# EAGLE design Shield (EAGLE 7.5.0)
USB / DC Solar Charger, Fuel gauge, Buck / Boost converter Shield
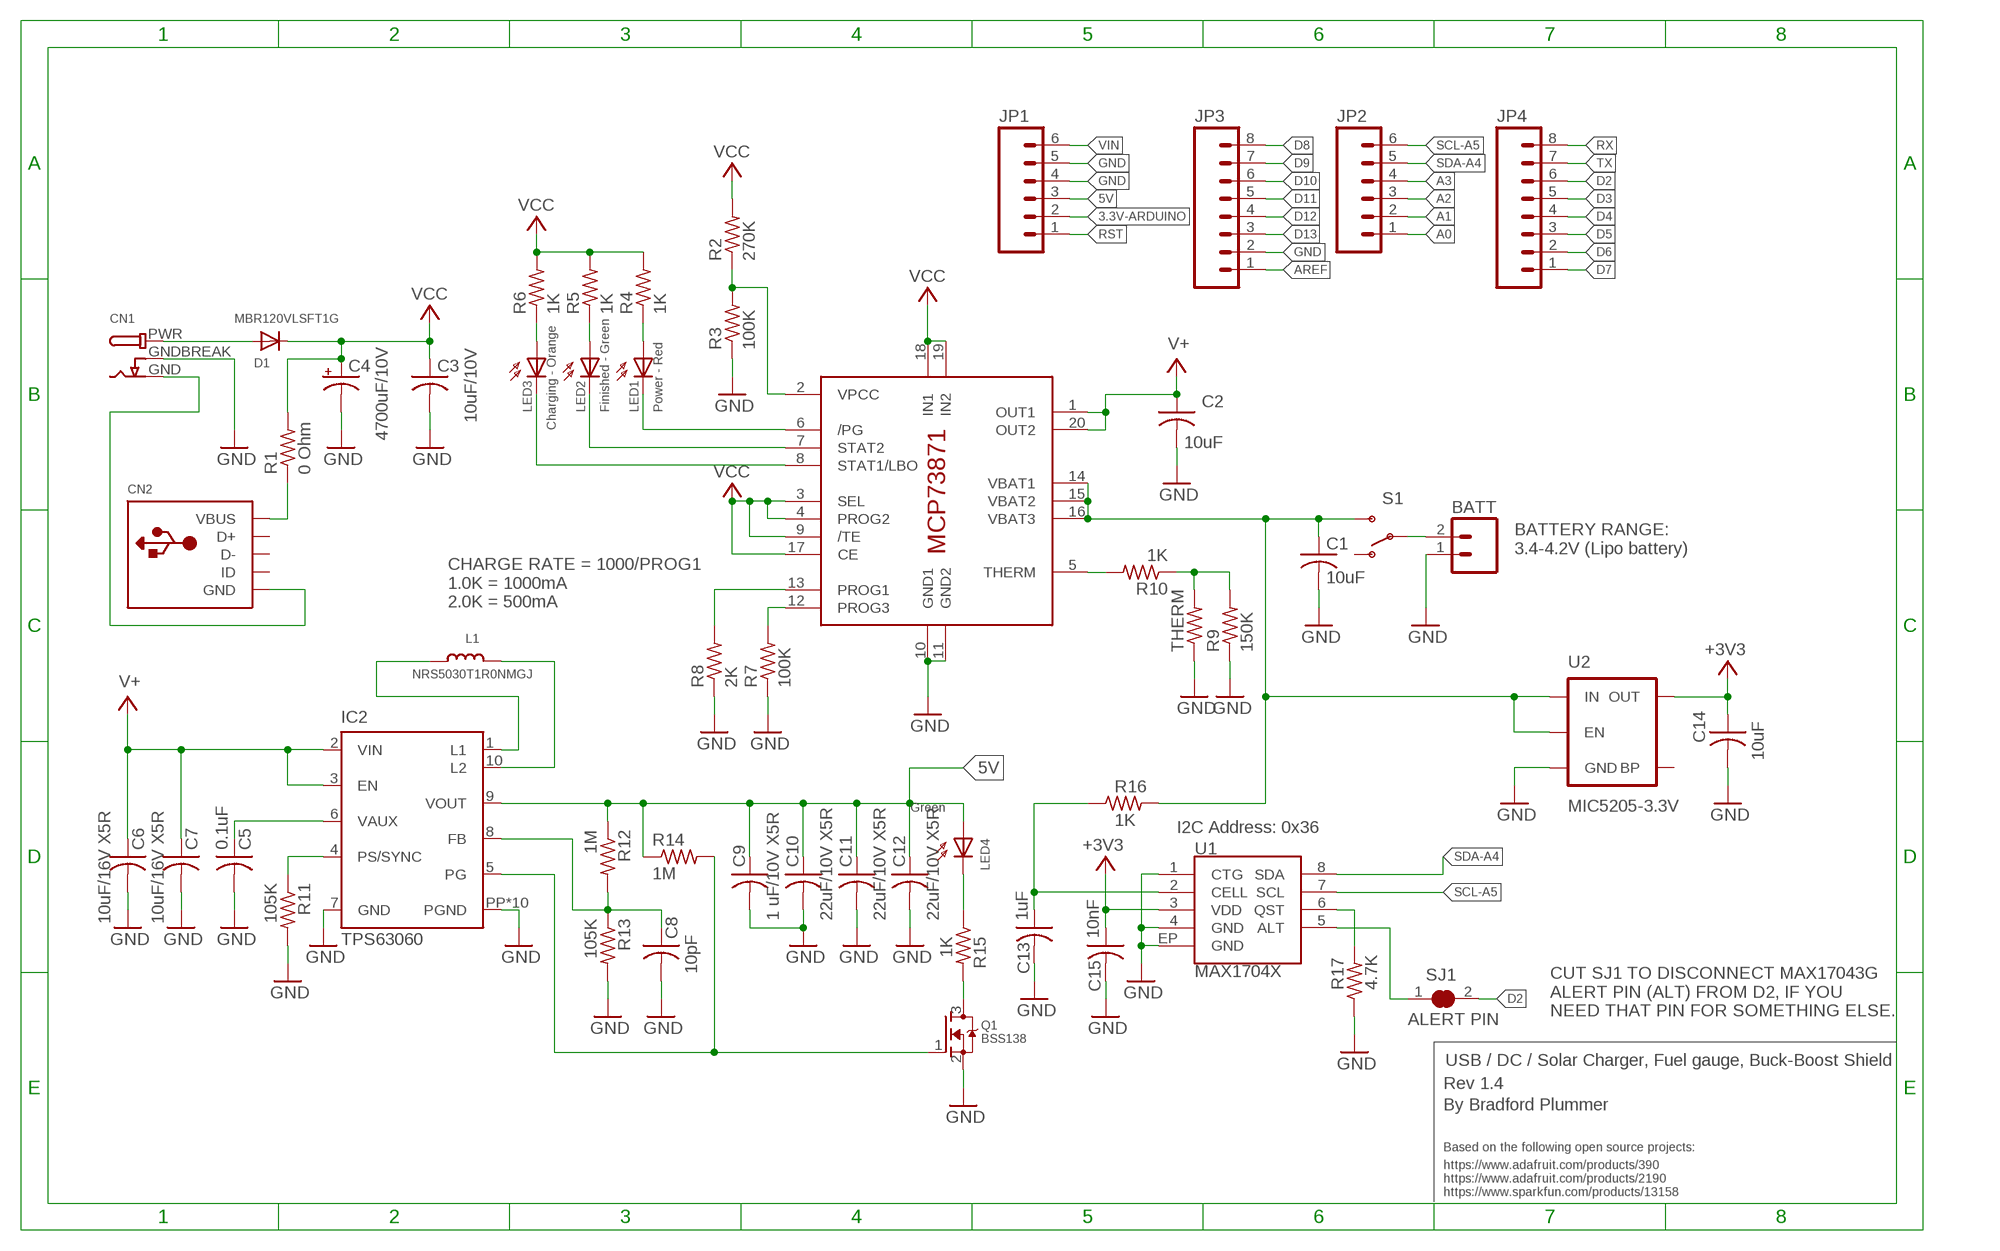
[diagram p0: schematic, sheet 1]

## Parts
BATT  M02JST-PTH-VERT  [JST-2-PTH-VERT]
C1  10uF  C-USC0805K  [C0805K]
C2  10uF  C-USC0805K  [C0805K]
C3  10uF/10V  C-USC0805K  [C0805K]
C4  4700uF/10V  CPOL-USE5-13  [E5-13]
C5  0.1uF  C-USC0805K  [C0805K]
C6  10uF/16V X5R  C-USC0805K  [C0805K]
C7  10uF/16V X5R  C-USC0805K  [C0805K]
C8  10pF  C-USC0805K  [C0805K]
C9  1 uF/10V X5R  C-USC0805K  [C0805K]
C10  22uF/10V X5R  C-USC0805K  [C0805K]
C11  22uF/10V X5R  C-USC0805K  [C0805K]
C12  22uF/10V X5R  C-USC0805K  [C0805K]
C13  1uF  C-USC0805K  [C0805K]
C14  10uF  C-USC0805K  [C0805K]
C15  10nF  C-USC0805K  [C0805K]
CN1  DCBARREL1.3MM  [DCJACK_1.3MM_PTH]
CN2  USBMINIB  [USB-MINIB]
D1  MBR120VLSFT1G  DIODESOD-123  [SOD-123]
IC1  MCP73871  [QFN20]
IC2  TPS63060  [DSC-S-PWSON-N10]
JP1  M06NO_SILK_FEMALE_PTH  [1X06_NO_SILK]
JP2  M06NO_SILK_FEMALE_PTH  [1X06_NO_SILK]
JP3  M08NO_SILK_FEMALE_PTH  [1X08_NO_SILK]
JP4  M08NO_SILK_FEMALE_PTH  [1X08_NO_SILK]
L1  NRS5030T1R0NMGJ  INDUCTORTDK_VLC5045  [INDUCTOR_5X5MM_TDK_VLC5045]
LED1  Power - Red  SFH205  [SFH205]
LED2  Finished - Green  SFH205  [SFH205]
LED3  Charging - Orange  SFH205  [SFH205]
LED4  Green  SFH205  [SFH205]
Q1  BSS138  MOSFET-NWIDE  [SOT23-WIDE]
R1  0 Ohm  R-US_R0805  [R0805]
R2  270K  R-US_R0805  [R0805]
R3  100K  R-US_R0805  [R0805]
R4  1K  R-US_R0805  [R0805]
R5  1K  R-US_R0805  [R0805]
R6  1K  R-US_R0805  [R0805]
R7  100K  R-US_R0805  [R0805]
R8  2K  R-US_R0805  [R0805]
R9  150K  R-US_M0805  [M0805]
R10  1K  R-US_M0805  [M0805]
R11  105K  R-US_M0805  [M0805]
R12  1M  R-US_M0805  [M0805]
R13  105K  R-US_M0805  [M0805]
R14  1M  R-US_M0805  [M0805]
R15  1K  R-US_M0805  [M0805]
R16  1K  R-US_M0805  [M0805]
R17  4.7K  R-US_M0805  [M0805]
S1  SWITCH-SPDTPTH  [SWITCH-SPDT]
SJ1  ALERT PIN  SJ  [SJ]
THERM  R-US_FLIPFLOP  [0805-THM]
U1  MAX1704X  [TDFN-8]
U2  MIC5205-3.3V  MIC52053.3V  [SOT23-5]

## Nets
3.3V-ARDUINO: JP1.2
5V: C9.1 C10.1 C11.1 C12.1 IC2.9(VOUT) JP1.3 LED4.A R12.1 R14.1
+3V3: C14.1 C15.1 U1.3(VDD) U2.5(OUT)
A0: JP2.1
A1: JP2.2
A2: JP2.3
A3: JP2.4
AREF: JP3.1
D2: JP4.6 SJ1.2
D3: JP4.5
D4: JP4.4
D5: JP4.3
D6: JP4.2
D7: JP4.1
D8: JP3.8
D9: JP3.7
D10: JP3.6
D11: JP3.5
D12: JP3.4
D13: JP3.3
GND: BATT.1 C1.2 C2.2 C3.2 C4.- C5.2 C6.2 C7.2 C8.2 C9.2 C10.2 C11.2 C12.2 C13.2 C14.2 C15.2 CN1.GNDBREAK IC1.10(GND1) IC1.11(GND2) IC2.7(GND) IC2.PP(PGND) IC2.PP@1(PGND) IC2.PP@2(PGND) IC2.PP@3(PGND) IC2.PP@4(PGND) IC2.PP@5(PGND) IC2.PP@7(PGND) IC2.PP@8(PGND) IC2.PP@9(PGND) IC2.PP@10(PGND) JP1.4 JP1.5 JP3.2 Q1.2(S) R3.1 R7.1 R8.1 R9.1 R11.2 R13.2 R17.1 THERM.1 U1.1(CTG) U1.4(GND) U1.EP(GND) U2.2(GND)
N$1: BATT.2 S1.2(P)
N$2: C1.1 IC1.14(VBAT1) IC1.15(VBAT2) IC1.16(VBAT3) R16.2 S1.3(S) U2.1(IN) U2.3(EN)
N$3: CN1.PWR D1.A
N$4: CN1.GND CN2.GND
N$5: CN2.VBUS R1.1
N$6: IC1.2(VPCC) R2.1 R3.2
N$7: IC1.6(/PG) LED1.K(C)
N$8: IC1.7(STAT2) LED2.K(C)
N$9: IC1.8(STAT1/LBO) LED3.K(C)
N$10: LED1.A R4.1
N$11: LED2.A R5.1
N$12: LED3.A R6.1
N$13: IC1.5(THERM) R10.2
N$14: IC1.12(PROG3) R7.2
N$15: IC1.13(PROG1) R8.2
N$16: R9.2 R10.1 THERM.2
N$17: IC2.1(L1) L1.P$1
N$18: IC2.10(L2) L1.P$2
N$19: IC2.4(PS/SYNC) R11.1
N$20: C5.1 IC2.6(VAUX)
N$21: C8.1 IC2.8(FB) R12.2 R13.1
N$22: Q1.3(D) R15.2
N$23: IC2.5(PG) Q1.1(G) R14.2
N$24: LED4.K(C) R15.1
N$25: C13.1 R16.1 U1.2(CELL)
N$26: R17.2 U1.6(QST)
N$27: SJ1.1 U1.5(ALT)
RST: JP1.1
RX: JP4.8
SCL-A5: JP2.6 U1.7(SCL)
SDA-A4: JP2.5 U1.8(SDA)
TX: JP4.7
V+: C2.1 C6.1 C7.1 IC1.1(OUT1) IC1.20(OUT2) IC2.2(VIN) IC2.3(EN)
VCC: C3.1 C4.+ D1.C IC1.3(SEL) IC1.4(PROG2) IC1.9(/TE) IC1.17(CE) IC1.18(IN1) IC1.19(IN2) R1.2 R2.2 R4.2 R5.2 R6.2
VIN: JP1.6
Unconnected: CN2.D+ CN2.D- CN2.ID S1.1(O) U2.4(BP)

## Notes on the sheet
- BATTERY RANGE:
  3.4-4.2V (Lipo battery)
- CHARGE RATE = 1000/PROG1
  1.0K = 1000mA
  2.0K = 500mA
- I2C Address: 0x36
- CUT SJ1 TO DISCONNECT MAX17043G 
  ALERT PIN (ALT) FROM D2, IF YOU 
  NEED THAT PIN FOR SOMETHING ELSE.
- USB / DC / Solar Charger, Fuel gauge, Buck-Boost Shield
- Rev 1.4
- By Bradford Plummer
- Based on the following open source projects:
- https://www.adafruit.com/products/390
  https://www.adafruit.com/products/2190
  https://www.sparkfun.com/products/13158

## Library data of the parts
BATT = SparkFun-Connectors:M02: Standard 2-pin 0.1" header. Use with - straight break away headers ( PRT-00116) - right angle break away headers (PRT-00553) - swiss pins (PRT-00743) - machine pins (PRT-00117) - female headers (PRT-00115) Molex polarized connector foot print use with: PRT-08233 with associated crimp pins and housings. 2.54_SCREWTERM for use with PRT-10571. 3.5mm Screw Terminal footprints for PRT-08084 5mm Screw Terminal footprints for use with PRT-08432
C1-C3 C5-C15 = rcl:C-US: CAPACITOR, American symbol
C4 = rcl:CPOL-US: POLARIZED CAPACITOR, American symbol
CN1 = microbuilder:DCBARREL: DC Barrel Jack DCJACK_1.3MM_PTH - Through Hole 1.3mm Jack (4UConnector: 05536) DCJACK_2MM_PTH - Through Hole 2.0/2.1 Jack (4UConnector: 05537) DCJACK_2MM_SMT - SMT 2.0/2.1mm Jack(4UConnector: 03267)
CN2 = microbuilder:USB: USB Connectors USBMINIB - Surface Mount Female Mini-B USB Connector 4UConnector: 06564
D1 = microbuilder:DIODE: Diode SMA Model Volts Amps Type Vf Vr Digikey # Notes SSA34-E3 40V 3A Schottky 480mV @ 3A 200uA @ 40V SSA34-E3/61TGITR-ND CDBA120-G 20V 1A Schottky 500mV @ 1A 500uA @ 20V 641-1014-6-ND REEL MBRA210 10V 2A Schottky 350mV @ 2A 700uA @ 10V MBRA210LT3 SOD-123 Model Volts Amps Type Vf Vr Order # Notes BAT54T1G 30V 200mA Schottky 800mV @ 200mA 2uA @ 25V BAT54T1GOSTR-ND B0530W 30V 500mA Schottky 430mV @ 500mA 130uA @ 30V B0530W-FDICT-ND REEL MBR120 1A 20V Schottky 340mV @ 1A MBR120VLSFT1GOSCT-ND SOD-323 Model Volts Amps Type Vf Vr Order # Notes PMEG2005EJ 20V 500mA Schottky 355mV @ 500mA 568-4110-1-ND ZLLS410 10V 570mA Schottky 380mV @ 570mA ZLLS410CT-ND 1N4148WS 75V 150mA Silicon/Simple 1V 1N4148WSFSCT-ND REEL SOD-523 Model Volts Amps Type Vf Vr Order # Notes BAT54XV2 30V 200mA Schottky 0.8V @ 100mA BAT54XV2CT-ND TB751S 30V 30mA Schottky RB751S-40TE61CT-ND SOT23-R/W (R = Solder Paste/Reflow Ovens, W = Hand-Soldering) Model Volts Amps Type Vf Vr Order # Notes BAT54FILM 40V 300mA Schottky 497-7162-1-ND
IC1 = adafruit:MCP73871
IC2 = texas:TPS6306*: HIGH INPUT VOLTAGE BUCK-BOOST CONVERTER WITH 2A SWITCH CURRENT Source: http://www.ti.com/lit/ds/symlink/tps63060.pdf
JP1 JP2 = SparkFun-Connectors:M06: Header 6 Standard 6-pin 0.1" header. Use with straight break away headers (SKU : PRT-00116), right angle break away headers (PRT-00553), swiss pins (PRT-00743), machine pins (PRT-00117), and female headers (PRT-00115). Molex polarized connector foot print use with SKU : PRT-08094 with associated crimp pins and housings. NOTES ON THE VARIANTS LOCK and LOCK_LONGPADS... This footprint was designed to help hold the alignment of a through-hole component (i.e. 6-pin header) while soldering it into place. You may notice that each hole has been shifted either up or down by 0.005 of an inch from it's more standard position (which is a perfectly straight line). This slight alteration caused the pins (the squares in the middle) to touch the edges of the holes. Because they are alternating, it causes a "brace" to hold the component in place. 0.005 has proven to be the perfect amount of "off-center" position when using our standard breakaway headers. Although looks a little odd when you look at the bare footprint, once you have a header in there, the alteration is very hard to notice. Also,if you push a header all the way into place, it is covered up entirely on the bottom side. This idea of altering the position of holes to aid alignment will be further integrated into the Sparkfun Library for other footprints. It can help hold any component with 3 or more connection pins.; PROD_ID: CONN-08437
JP3 JP4 = SparkFun-Connectors:M08: Header 8 Standard 8-pin 0.1" header. Use with straight break away headers (SKU : PRT-00116), right angle break away headers (PRT-00553), swiss pins (PRT-00743), machine pins (PRT-00117), and female headers (PRT-00115).; PROD_ID: CONN-08438
L1 = microbuilder:INDUCTOR: Inductors 0603: 10nH Ceramic Inductor - microwire antenna/RF (Digikey: 712-1434-2-ND) 0805: 560nH Ceramic Inductor - RF (Digikey: 553-1047-1-ND) 270nH Ceramic Inductor - Q = 40@250MHz, +-5%, 1 Ohm DC Resistance (Digikey: 535-10506-2-ND) 1007 (2518 Metric) SMT: 10µH 10% 250mOhm 820mA 1007 Inductor (Digikey: 587-2189-1-ND) 22µH 10% 500mOhm 580mA 1007 Inductor (Digikey: 587-2190-1-ND) 47µH 10% 950mOhm 420mA 1007 Inductor (Digikey: 587-2191-1-ND) 47µH 5% 100mOhm 1A 1008 Inductor (Digikey: 732-1816-1-ND) 5.0x5.0mm (Taiyo Yuden NR5040 Series) 6.8µH 20% 2.3A 64mOhm Inductor (Digikey: 587-2374-2-ND) 5.0x5.0mm (TDK VLC5045 Series) 4.7µH 20% 3.3A 34mOhm Inductor (Digikey: 445-6526-1-ND) 6.8µH 20% 2.7A 46mOhm Inductor (Digikey: 445-6527-1-ND) 6.0x6.0mm (TDK VLC6045 Series) 4.7µH 20% 3.8A 27mOhm Inductor (Digikey: 445-6538-2-ND) 6.8µH 20% 3A 41mOhm Inductor (Digikey: 445-6540-1-ND) 6.2µH 30% 2.2A 45mOhm Inductor (Digikey: SRR5028-6R2YCT-ND) - Not TDK VLC6045 but footprint should match 6.0x6.0mm (TDK SLF6045 Series) 6.8uH 30% 2A 33mOhm Inductor (Digikey: 445-4572-1-ND, Mouser: 810-SLF645T6R8N2R0PF)
LED1-LED4 = opto-trans-siemens:SFH205: PHOTO DIODE; OC_FARNELL: unknown; OC_NEWARK: unknown
Q1 = microbuilder:MOSFET-N: N-Channel Mosfet LEGEND VDS: Voltage Drain-Source ID: Drain Current RDS(ON): Drain-Source On-State Resistance VGS(TH): Gate-Source Threshold Voltage CISS: Drain-Source Input Capacitance SOT-23 Name VDS ID RDS(ON) VGS(TH) CISS Order Number 2N7002E 60V 260mA 2.5 Ohm 2.5V @ 250uA 26.7pF @ 25V 2N7002ET1GOSTR-ND BSH103 30V 850mA 400 mOhm 400mV @ 1mA 83pF @ 24V BSH103,235-ND BSS138 60V 320mA 1.6 Ohm 1.5V @ 250uA 50pF @ 10V Mouser: 771-BSS138PW115 DMN2075U-7 20V 4.2A 38 mOhm 1V @ 250 uA 594.3pF @ 10V DMN2075U-7DICT-ND * BSS138 good choice for I2C level-shifting
R1-R17 THERM = adafruit:R-US_: RESISTOR, American symbol
S1 = SparkFun-Electromechanical:SWITCH-SPDT: SPDT Switch Simple slide switch, Spark Fun Electronics SKU : COM-00102 DPDT SMT slide switch, AYZ0202, SWCH-08179; PROD_ID: SWCH-08261
SJ1 = jumper:SJ: SMD solder JUMPER
U1 = SparkFun-PowerIC:MAX1704X: MAX17043/MAX17044: Battery Fuel Guage (43 is 1cell, 44 is 2cell); PROD-ID: IC-10399
U2 = SparkFun-PowerIC:MIC5205: MIC5205 150mA vreg 3.3V - VREG-00822 5V - VREG-00823; PROD_ID: VREG-00822

## Board
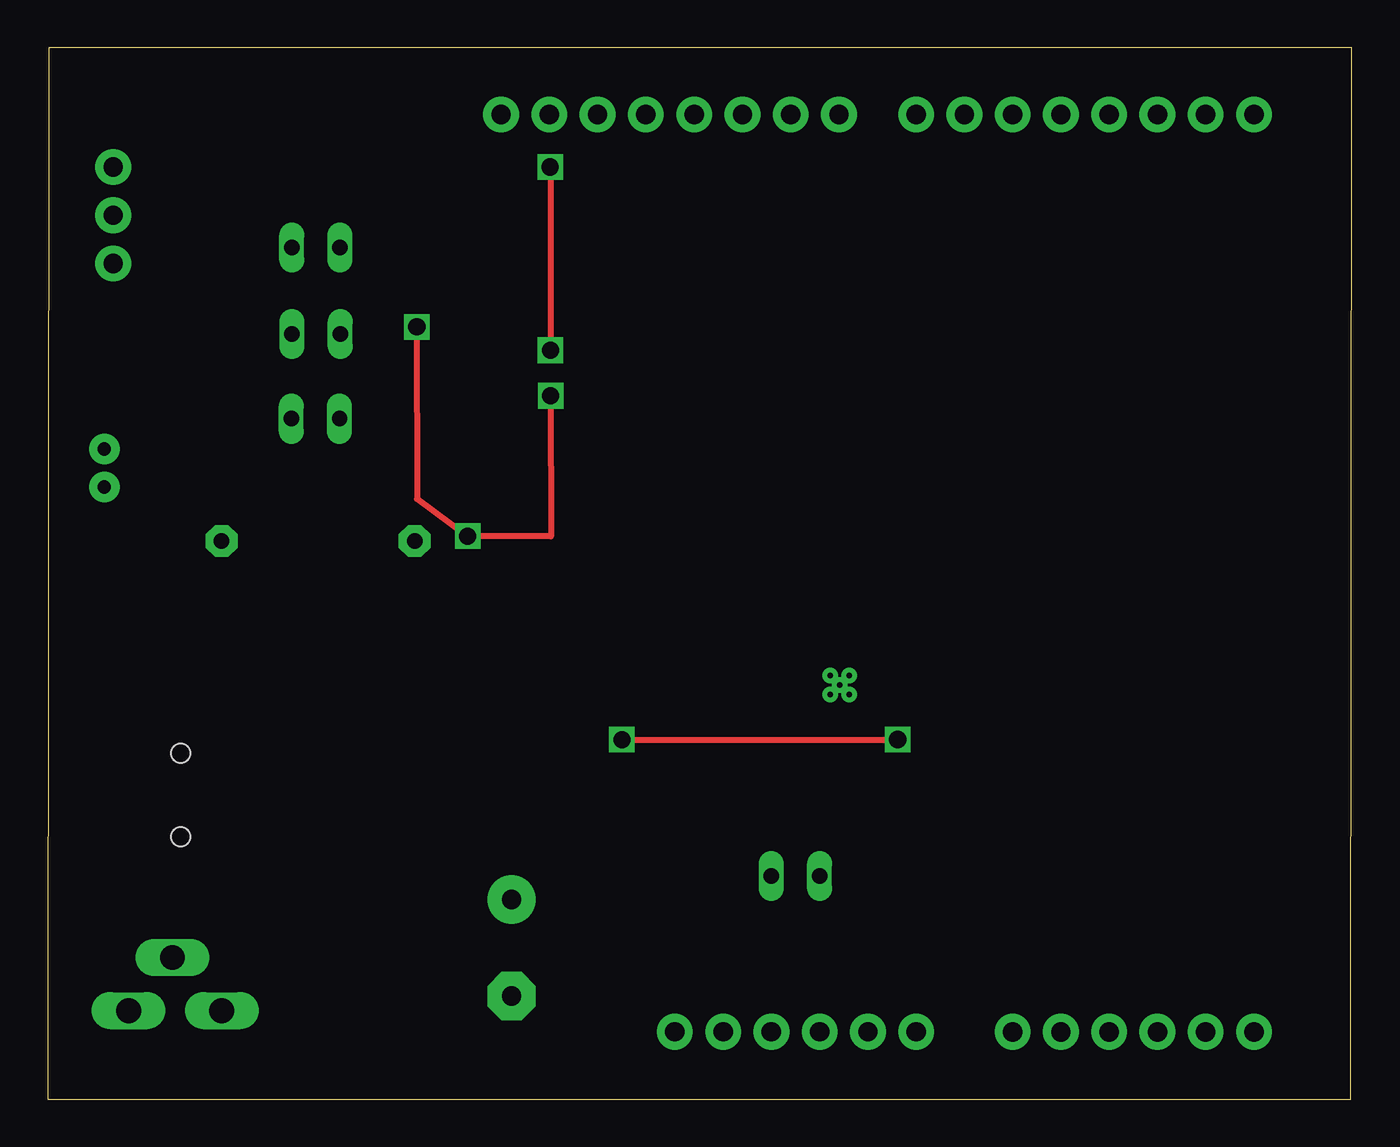
[diagram p1: board, top side]
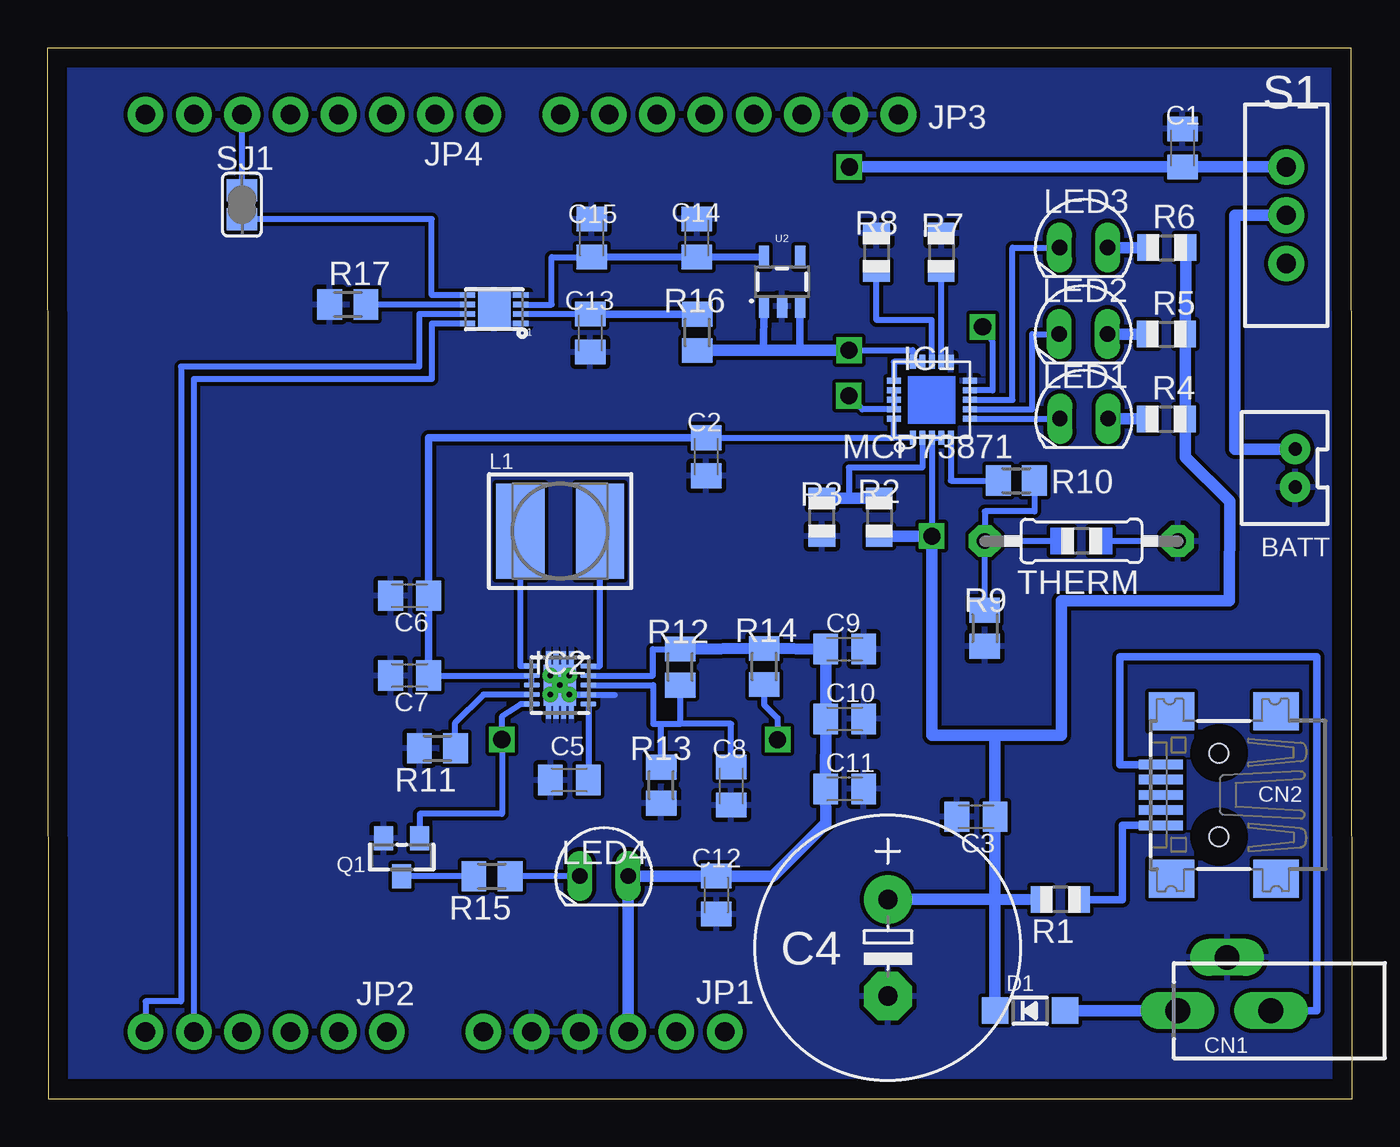
[diagram p2: board, bottom side, seen from below]

Size 68.66 x 55.34 mm. Coordinates in mm from the lower left corner, seen from the top.
Outline: 0,0.01 68.59,0 68.66,55.34 0.07,55.31 0,0.01
Copper layers (1*16): Top 0.035mm / dielectric 1.5mm / Bottom 0.035mm
Design rules "default": minimum track width 10mil, minimum drill 24mil, track to track 8mil, track to pad 8mil, pad to pad 8mil, via to via 8mil, smd to smd 8mil, copper to edge 40mil, drill to drill 8mil, minimum pad ring 10mil, minimum via ring 8mil, stop-mask expansion 4mil, vias tented up to drill 0mil, thermal gap 10mil

### Footprints (pad centres in the part's own frame; a part is rotated, then mirrored left to right if it is on the bottom)
JST-2-PTH-VERT = drill 0.7 pad 1.6: 1 -1,-0.55; 2 1,-0.55
C0805K = smd 1.3 x 1.6: 1 -1,0; 2 1,0
E5-13 = drill 1.016 pad 2.54: + -2.54,0 | drill 1.016 pad 2.54 octagon: - 2.54,0
DCJACK_1.3MM_PTH = drill 1.3 long: GND 0,6; GNDBREAK 2.8,8.3; PWR 0,10.9
USB-MINIB = smd 0.5 x 2.308: D+ 0,4.064; D- -0.8,4.064; GND 1.6,4.064; ID 0.8,4.064; VBUS -1.6,4.064 | smd 2 x 2.4: GND1 -4.4,-2; GND2 -4.4,3.5; GND3 4.4,3.5; GND4 4.4,-2 | hole 1: -2.2,1; 2.2,1
SOD-123 = smd 1.4 x 1.4: A 1.85,0; C -1.85,0
QFN20 = smd 0.75 x 0.3: 1 -2,1; 2 -2,0.5; 3 -2,0; 4 -2,-0.5; 5 -2,-1; 11 2,-1; 12 2,-0.5; 13 2,0; 14 2,0.5; 15 2,1 | smd 0.3 x 0.75: 6 -1,-2; 7 -0.5,-2; 8 0,-2; 9 0.5,-2; 10 1,-2; 16 1,2; 17 0.5,2; 18 0,2; 19 -0.5,2; 20 -1,2
DSC-S-PWSON-N10 = smd 0.28 x 0.85: 1 -1,-1.488; 2 -0.5,-1.488; 3 0,-1.488; 4 0.5,-1.488; 5 1,-1.488; 6 1,1.5; 7 0.5,1.5; 8 0,1.5; 9 -0.5,1.5; 10 -1,1.5 | smd 2.15 x 1.7: PP 0,0 | smd 3.55 x 0.25: PP@1 0,0.6; PP@2 0,0.2; PP@3 0,-0.2; PP@4 0,-0.6 | drill 0.3 pad 0.4: PP@5 -0.5,0.5; PP@7 0,0; PP@8 0.5,0.5; PP@9 -0.5,-0.5; PP@10 0.5,-0.5
1X06_NO_SILK = drill 1.016 pad 1.88: 1 0,0; 2 2.54,0; 3 5.08,0; 4 7.62,0; 5 10.16,0; 6 12.7,0
1X08_NO_SILK = drill 1.016 pad 1.88: 1 0,0; 2 2.54,0; 3 5.08,0; 4 7.62,0; 5 10.16,0; 6 12.7,0; 7 15.24,0; 8 17.78,0
INDUCTOR_5X5MM_TDK_VLC5045 = smd 2.54 x 5: P$1 -2.096,0; P$2 2.096,0
SFH205 = drill 0.813 long: A 0,-1.27; K 0,1.27
SOT23-WIDE = smd 1 x 1.27: 1 -0.95,-1; 2 0.95,-1; 3 0,1
R0805 = smd 1.1 x 1.4: 1 -1,0; 2 1,0
M0805 = smd 1.3 x 1.6: 1 -0.95,0; 2 0.95,0
SWITCH-SPDT = drill 1.016 pad 1.88: 1 0,2.54; 2 0,0; 3 0,-2.54
SJ = smd 1.168 x 1.6: 1 -0.762,0; 2 0.762,0
0805-THM = drill 0.813 pad 1.676 octagon: 1 -5.08,0; 2 5.08,0
TDFN-8 = smd 0.8 x 0.3: 1 -1.4,0.75; 2 -1.4,0.25; 3 -1.4,-0.25; 4 -1.4,-0.75; 5 1.4,-0.75; 6 1.4,-0.25; 7 1.4,0.25; 8 1.4,0.75 | smd 1.73 x 1.88: EP 0,0
SOT23-5 = smd 0.55 x 1.2: 1 -0.95,-1.3; 2 0,-1.3; 3 0.95,-1.3; 4 0.95,1.3; 5 -0.95,1.3

### Placement (x,y rotation side)
BATT  3.54,33.21 90 bottom
C1  8.92,50.05 90 bottom
C2  33.99,33.8 270 bottom
C3  19.79,14.86 180 bottom
C4  24.43,7.97 270 bottom
C5  41.19,16.8 180 bottom
C6  49.6,26.49 180 bottom
C7  49.6,22.29 180 bottom
C8  32.67,16.48 270 bottom
C9  26.7,23.68 0 bottom
C10  26.7,20.01 0 bottom
C11  26.7,16.33 0 bottom
C12  33.45,10.74 270 bottom
C13  40.09,40.31 270 bottom
C14  34.48,45.31 90 bottom
C15  40.02,45.31 90 bottom
CN1  -1.73,4.66 90 bottom
CN2  6,16.01 90 bottom
D1  16.94,4.66 0 bottom
IC1  22.11,36.8 90 bottom
IC2  41.69,21.79 270 bottom
JP1  33.02,3.55 180 bottom
JP2  50.8,3.54 180 bottom
JP3  23.88,51.81 180 bottom
JP4  45.72,51.81 180 bottom
L1  41.67,29.9 0 bottom
LED1  14.11,35.8 90 bottom
LED2  14.14,40.25 90 bottom
LED3  14.12,44.8 90 bottom
LED4  39.37,11.73 90 bottom
Q1  50.02,12.74 180 bottom
R1  15.36,10.5 180 bottom
R2  24.88,30.62 270 bottom
R3  27.9,30.63 90 bottom
R4  9.78,35.79 0 bottom
R5  9.77,40.25 0 bottom
R6  9.74,44.8 0 bottom
R7  21.61,44.55 270 bottom
R8  25.03,44.55 270 bottom
R9  19.32,24.78 90 bottom
R10  17.66,32.55 180 bottom
R11  48.13,18.46 180 bottom
R12  35.37,22.74 270 bottom
R13  36.37,16.52 270 bottom
R14  30.94,22.77 270 bottom
R15  45.27,11.73 180 bottom
R16  34.47,40.35 270 bottom
R17  52.86,41.81 0 bottom
S1  3.46,46.51 180 bottom
SJ1  58.42,47.06 90 bottom
THERM  14.24,29.37 180 bottom
U1  45.15,41.56 180 bottom
U2  30,43.01 0 bottom

### Tracks (layer width: path | path; a pad name or v marks a point on that pad's centre or on a via)
5V
  Bottom 0.305: IC2.9 36.79,22.29 36.79,23.69 R12.1
  Bottom 0.61: R12.1 R14.1 C9.1 C10.1 C11.1 27.7,14.53 30.48,11.74 C12.1 LED4.A JP1.3
+3V3
  Bottom 0.305: U1.3 42.12,41.81 42.12,44.31 C15.1
  Bottom 0.406: U2.5 C14.1 C15.1
D2
  Bottom 0.305: SJ1.2 JP4.6
GND
  Bottom 0.305: IC2.7 IC2.PP@8 | IC2.PP@10 38.81,21.28
  pour Bottom: 0.23,1.21 68.39,1.21 68.45,54.16 0.2,54.14
N$1
  Bottom 0.61: S1.2 6.17,46.51 6.17,34.21 BATT.2
N$2  (via drill 0.9)
  Top 0.305: v26.46,49.05 26.48,49.03 v26.47,39.41
  Bottom 0.305: IC1.14 IC1.15 | IC1.15 24.11,38.8 IC1.16 | v26.47,39.41 23.11,39.41 IC1.15
  Bottom 0.406: U2.3 29.05,39.41 | U2.1 30.96,39.41
  Bottom 0.61: v26.47,39.41 29.05,39.41 30.96,39.41 R16.2 | S1.3 C1.1 v26.46,49.05
N$3
  Bottom 0.61: CN1.PWR D1.A
N$4
  Bottom 0.406: CN2.GND 12.21,17.61 12.21,23.28 1.84,23.28 1.84,4.65 CN1.GND
N$5
  Bottom 0.406: CN2.VBUS 12.1,14.41 12.1,10.5 R1.1
N$6
  Bottom 0.305: IC1.2 22.61,33.23 26.48,33.23 26.49,31.63
  Bottom 0.61: R2.1 26.49,31.63 R3.2
N$7
  Bottom 0.305: IC1.6 LED1.K
N$8
  Bottom 0.305: IC1.7 16.82,36.3 16.82,40.25 LED2.K
N$9
  Bottom 0.305: IC1.8 17.87,36.8 17.87,44.8 LED3.K
N$10
  Bottom 0.61: R4.1 LED1.A
N$11
  Bottom 0.61: R5.1 LED2.A
N$12
  Bottom 0.61: R6.1 LED3.A
N$13
  Bottom 0.305: IC1.5 21.11,32.55 R10.2
N$14
  Bottom 0.305: IC1.12 R7.2
N$15
  Bottom 0.305: IC1.13 22.11,40.99 25.03,40.99 R8.2
N$16
  Bottom 0.305: R10.1 16.71,30.94 19.32,30.94 THERM.2 R9.2
N$17
  Bottom 0.305: IC2.1 43.77,22.79 L1.P$1
N$18
  Bottom 0.305: IC2.10 39.58,22.79 L1.P$2
N$19
  Bottom 0.305: IC2.4 45.72,21.29 47.2,19.81 R11.1
N$20
  Bottom 0.305: IC2.6 C5.1
N$21
  Bottom 0.305: R12.2 35.37,19.75 | C8.1 32.67,19.75 35.37,19.75 | IC2.8 36.78,21.79 36.78,19.75 36.37,19.75 | 36.37,19.75 35.37,19.75 | R13.1 36.37,19.75
N$22
  Bottom 0.305: R15.2 Q1.3
N$23  (via drill 0.9)
  Top 0.305: v30.23,18.92 v44.74,18.93
  Bottom 0.305: Q1.1 49.07,15.01 44.74,15.01 v44.74,18.93 44.76,20.12 43.74,20.79 IC2.5 | R14.2 30.94,20.76 30.23,20.05 v30.23,18.92
N$24
  Bottom 0.305: LED4.K R15.1
N$25
  Bottom 0.305: C13.1 U1.2
  Bottom 0.406: R16.1 C13.1
N$26
  Bottom 0.305: U1.6 R17.2
N$27
  Bottom 0.305: U1.5 48.44,42.31 48.44,46.3 SJ1.1
SCL-A5
  Bottom 0.305: U1.7 49.09,41.31 49.09,38.54 61.63,38.54 61.63,5.15 63.5,5.15 JP2.6
SDA-A4
  Bottom 0.305: U1.8 48.44,40.81 48.44,37.89 60.96,37.88 JP2.5
V+
  Bottom 0.305: IC1.1 24.11,34.8 | 24.11,34.8 IC1.20 | C2.1 24.11,34.8 | IC2.3 IC2.2 C7.1
  Bottom 0.406: C7.1 C6.1 48.6,34.8 C2.1
VCC  (via drill 0.9)
  Top 0.305: v19.44,40.63 19.45,31.59 v22.12,29.62 26.5,29.62 v26.48,37.02
  Bottom 0.305: IC1.4 IC1.3 v22.12,29.62 | IC1.17 IC1.18 IC1.19 25.77,36.3 v26.48,37.02 | v19.44,40.63 18.93,39.84 18.93,37.29 IC1.9
  Bottom 0.61: D1.C 18.8,10.51 | R1.2 18.8,10.51 | 18.8,10.51 C4.+ | R6.2 R5.2 R4.2 8.78,33.78 6.44,31.46 6.45,26.24 15.29,26.24 15.29,19.14 18.8,19.14 | 18.8,10.51 C3.1 18.8,19.14 | 18.8,19.14 22.12,19.14 v22.12,29.62 R2.2